# EasyEDA Pro project ProDoc_UI_2025-10-13.epro

# Schematic UserInteraction
Board Name: UserInteraction; Create Date: 2025-09-14; Page Name: P1; Project Name: STM32 Desktop Drumkit v1; Schematic Name: UI; Update Date: 2025-09-14; Company: CQUPT; Drawed: WilliTourt; Page Size: A4; Reviewed: WilliTourt; Version: V1.0
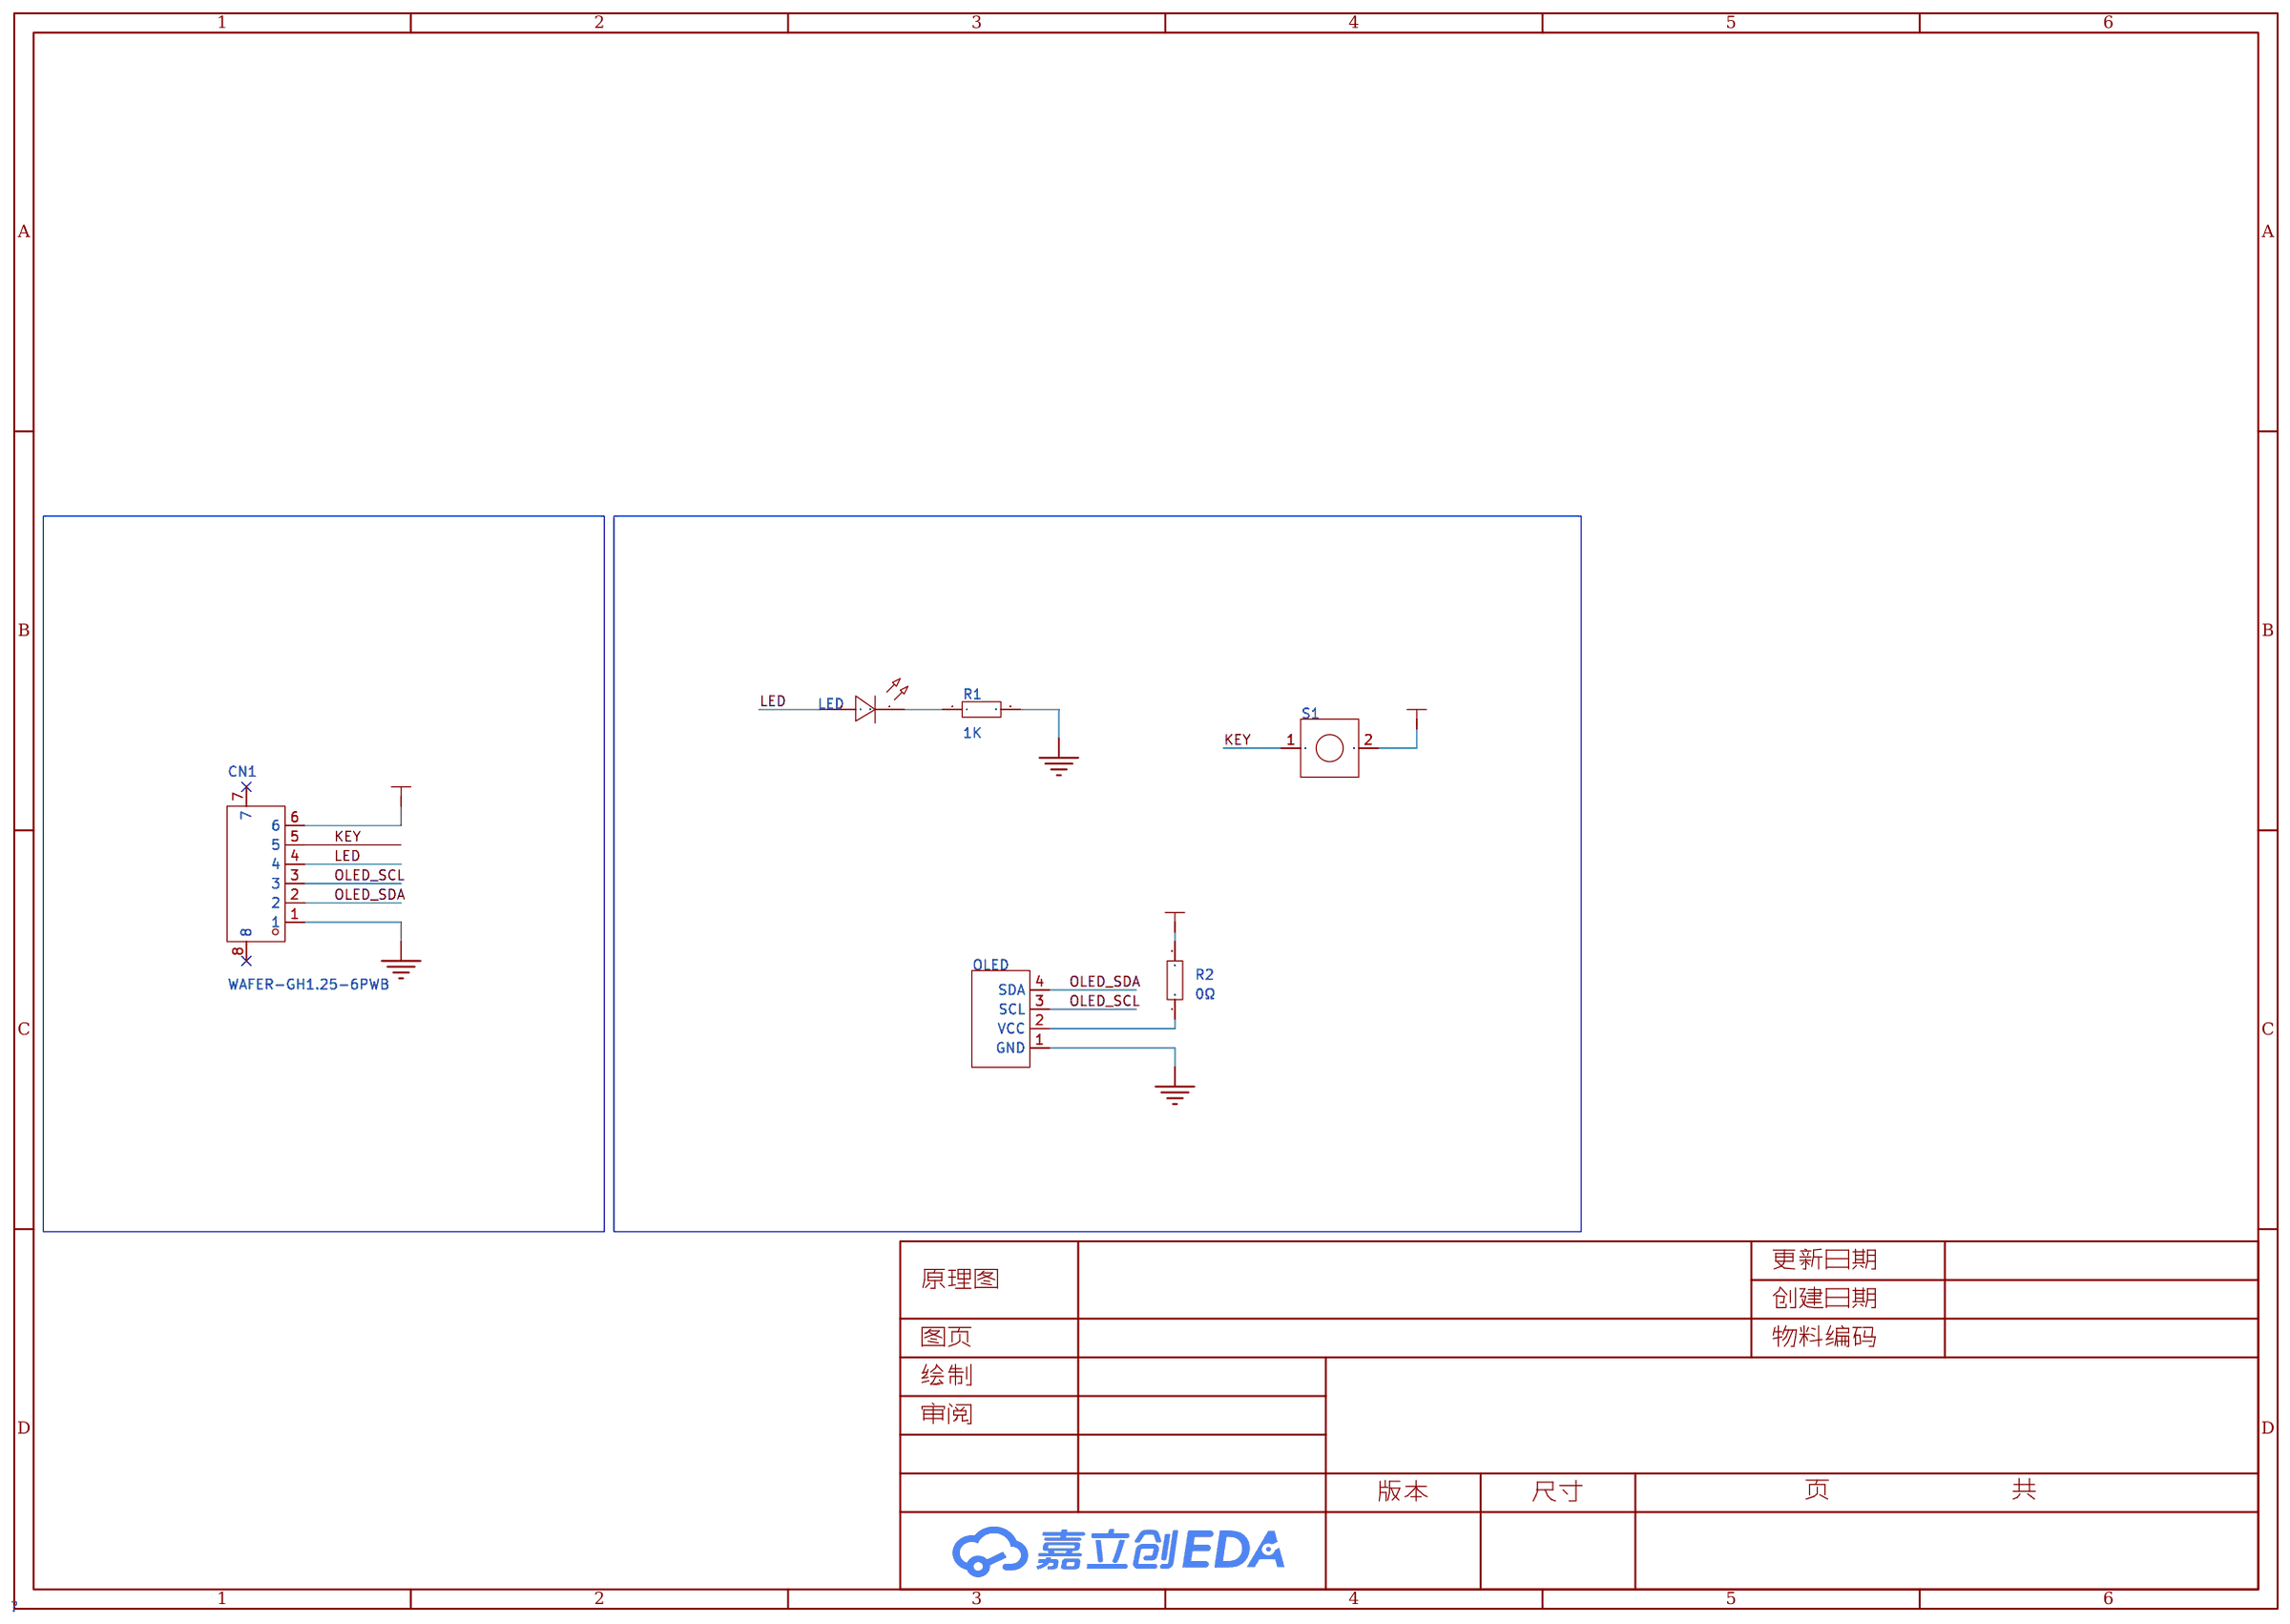
[diagram p0: schematic sheet]

## Parts
CN1  WAFER-GH1.25-6PWB  [CONN-SMD_6P-P1.25_XUNPU_WAFER-GH1.25-6PWB]
LED  -  [LED0603]
OLED  -  [MOULD-OLED-0.91-12832-I2C-SSD1306]
R1  1K  [R0603]
R2  0Ω  [R0603]
S1  -  [6*6*5 硅胶开关]

## Library data of the parts
CN1 = WAFER-GH1.25-6PWB: 插针结构:1x6P;间距:1.25mm;安装方式:卧贴;参考系列:GH;总PIN数:6P;排数:1;每排PIN数:6;行距:-;额定电流:1A;触头材质:黄铜;触头镀层:-;工作温度范围:-25℃~+85℃;; LCSC Part Name: 1x6P 间距:1.25mm 卧贴 系列:GH; Supplier Part: C3029381; Manufacturer: XUNPU(讯普); Supplier Footprint: SMD,P=1.25mm,卧贴; JLCPCB Part Class: 扩展库; Datasheet: https://atta.szlcsc.com/upload/public/pdf/source/20220527/CB8773BFB0913C3B8ABD62CB38BA101A.pdf; Supplier: LCSC; Pins Structure: 1x6P; Pitch: 1.25mm; Mounting Type: 卧贴; Reference Series: GH; Number of Pins: 6P; Number of Rows: 1; Number of PINs Per Row: 6; Current Rating: 1A; Contact Material: 黄铜; Operating Temperature: -25℃~+85℃; Voltage Rating: 125V; Plastic Material: LCP; Supplementary Features: 辅助焊脚; Color: 米色; Z-Height of the Board: 4.35mm; X-Length of Bottom Edge on Board (Spacing Line): 10.75mm; Y-Width of Bottom Edge on Board: 5mm
LED = LED0603-WHITE
OLED = 模组-OLED-0.91-12832-I2C-SSD1306
R1 R2 = R0603: Supplier Footprint: 0603
S1 = 6*6*5 硅胶开关

## Nets
5V: CN1.6 R2.2 S1.2
GND: CN1.1 OLED.1(GND) R1.2
KEY: CN1.5 S1.1
LED: CN1.4 LED.2(A)
OLED_SCL: CN1.3 OLED.3(SCL)
OLED_SDA: CN1.2 OLED.4(SDA)
$1N122: LED.1(C) R1.1
$1N423: OLED.2(VCC) R2.1

Not connected (* = marked no-connect by the designer): CN1 7* 8*

# Board PCB2
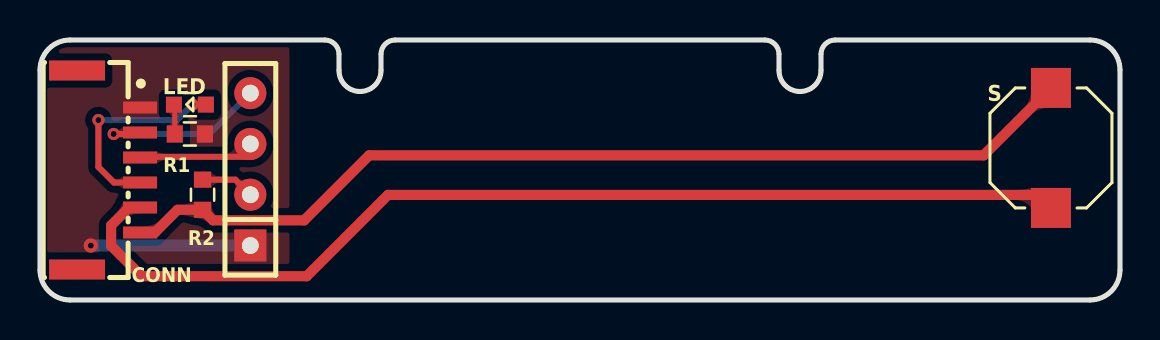
[diagram p1: board, top side]
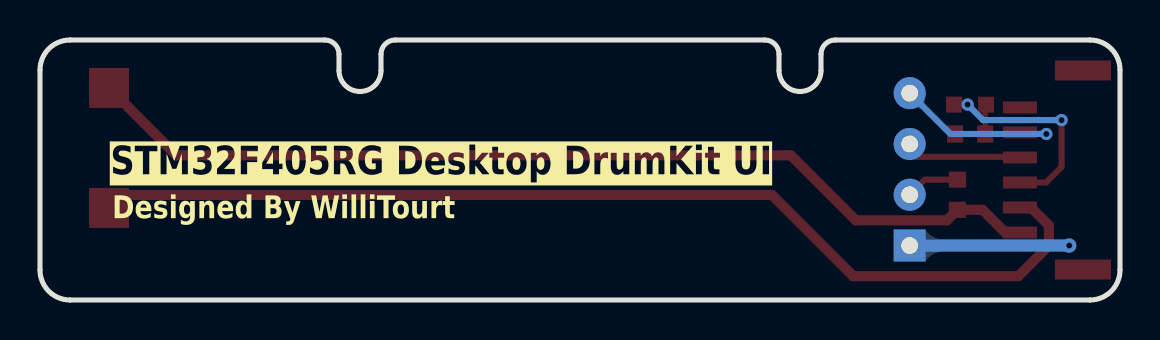
[diagram p2: board, bottom side, seen from below]

Outline 54 x 13 mm; copper layers: Top Layer, Bottom Layer. Coordinates in mm from the lower left corner of the outline.
Outline path: 0,11.5 arc(0.44,12.56) 1.5,13 14.24,13 arc(14.74,12.79) 14.95,12.29 14.95,11.48 arc(16,10.43) 17.05,11.48 17.05,12.29 arc(17.26,12.79) 17.76,13 36.24,13 arc(36.74,12.79) 36.95,12.29 36.95,11.48 arc(38,10.43) 39.05,11.48 39.05,12.29 arc(39.26,12.79) 39.76,13 52.5,13 arc(53.56,12.56) 54,11.5 54,1.5 arc(53.56,0.44) 52.5,0 1.5,0 arc(0.44,0.44) 0,1.5 0,11.5
Stack: Top Layer 0.035mm / Dielectric1 1.51mm FR4 er 4.5 / Bottom Layer 0.035mm

## Design rules (mm)
template: 自定义配置
spacing copperThickness1oz (default): track to track 0.102, other pairs 0.152 to 0.3
spacing copperThickness2oz: track to track 0.203, other pairs 0.152 to 0.3
track width copperThickness1oz (default): min 0.127, default 0.254, max 2.54
track width copperThickness2oz: min 0.203, default 0.254, max 2.54
differential pair differentialPair (default): width min 0.127, default 0.254, max 2.54; gap min 0.152, default 0.152
via viaSize (default): diameter min 0.5, default 0.61, max 10; hole min 0.3, default 0.305, max 6.3

## Placement (name value [footprint] x y rotation side)
CONN  WAFER-GH1.25-6PWB  [CONN-SMD_6P-P1.25_XUNPU_WAFER-GH1.25-6PWB]  3.43 6.5 270 top
LED  -  [LED0603]  7.55 9.78 0 top
OLED  -  [MOULD-OLED-0.91-12832-I2C-SSD1306]  9.02 6.52 0 top
R1  1K  [R0603]  7.49 8.3 0 top
R2  0Ω  [R0603]  8.13 5.26 270 top
S  -  [6*6*5 硅胶开关]  47.5 4.6 90 top

## Footprints (pads in the part's own frame, mm; a bottom-side part is the same pattern mirrored in y, then rotated)
6*6*5 硅胶开关
  rect 2x2 smd: 1(0,-3.05) 2(6,-3.05)
CONN-SMD_6P-P1.25_XUNPU_WAFER-GH1.25-6PWB
  rect 0.6x1.7 smd: 1(-3.125,1.575) 2(-1.875,1.575) 3(-0.625,1.575) 4(0.625,1.575) 5(1.875,1.575) 6(3.125,1.575)
  rect 1x2.8 smd: 7(4.975,-1.575) 8(-4.975,-1.575)
LED0603
  rect 0.8x0.8 smd: 1(-0.851,-0.01) 2(0.75,-0.005)
MOULD-OLED-0.91-12832-I2C-SSD1306
  rect 1.6x1.6 hole 0.813x0.838: 1(1.5,-3.8)
  round 1.6 hole 0.813x0.838: 2(1.5,-1.26) 3(1.5,1.28) 4(1.5,3.82)
R0603
  rect 0.806x0.864 smd: 1(-0.753,0) 2(0.753,0)

## Nets
5V: CONN.6 R2.2 S.2
GND: CONN.1 OLED.1 R1.2
KEY: CONN.5 S.1
LED: CONN.4 LED.2
OLED_SCL: CONN.3 OLED.3
OLED_SDA: CONN.2 OLED.4
$1N122: LED.1 R1.1
$1N423: OLED.2 R2.1

Pads without a net: CONN 7 8

## Via types
v1: diameter 0.61, hole 0.305, Top Layer to Bottom Layer, 3 vias
v2: diameter 0.711, hole 0.305, Top Layer to Bottom Layer, 1 via

## Routing (per net, layer and track width the routed paths; a pad name or vN(x,y) marks a point on that pad's centre or on a via; arc(x,y) is an arc through that point)
5V: length 49
  Top Layer w0.508: CONN.6 5.74,3.38 6.88,4.51 R2.2 8.65,3.98 13.21,3.98 16.46,7.23 47.18,7.23 S.2
GND: length 8
  Bottom Layer w0.61: OLED.1 v2(2.54,2.72)
KEY: length 52.4
  Top Layer w0.508: S.1 49.9,5.25 17.4,5.25 13.34,1.19 5.08,1.19 3.56,2.71 3.56,3.73 4.45,4.62 CONN.5
LED: length 10.4
  Top Layer w0.305: CONN.4 3.7,5.88 2.92,6.65 v1(2.92,9) ; LED.2 v1(7.62,9.77)
  Bottom Layer w0.305: v1(2.92,9) 6.84,9 v1(7.62,9.77)
OLED_SCL: length 6.2
  Top Layer w0.305: OLED.3 10.52,7.16 5.14,7.16 5,7.02
OLED_SDA: length 9
  Top Layer w0.305: 5,8.27 4.97,8.3 v1(3.68,8.3)
  Bottom Layer w0.305: v1(3.68,8.3) 8.47,8.3 10.52,10.34
$1N122: length 1.5
  Top Layer w0.254: R1.1 6.74,9.72 LED.1
$1N423: length 2.7
  Top Layer w0.305: 10.52,5.26 9.76,6.02 R2.1

## Copper pours and planes (outline as drawn; the poured copper is in the pictures)
GND on Top Layer: -2.41,14.78 12.57,14.78 12.57,-1.86 -2.41,-1.86

Small or netless copper shapes (teardrops, artwork), in the pictures only: 18 on Top Layer, 6 on Bottom Layer

## Text on the board
Bottom Silkscreen Layer: Designed By WilliTourt | STM32F405RG Desktop DrumKit UI
